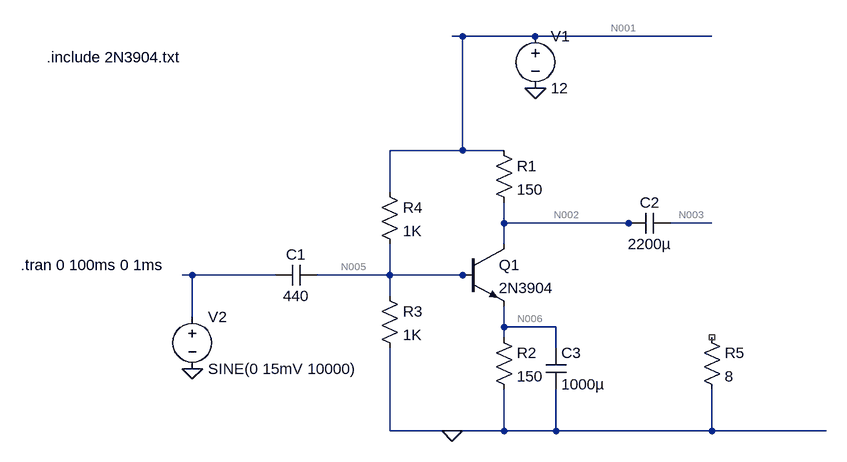
[diagram p0: schematic Common Emitter with 2N3904-1.asc]
Common Emitter with 2N3904-1.asc, the LTspice schematic file:
Version 4
SHEET 1 1032 680
WIRE 160 -256 144 -256
WIRE 272 -256 160 -256
WIRE 544 -256 272 -256
WIRE 160 -80 160 -256
WIRE 160 -80 48 -80
WIRE 224 -80 160 -80
WIRE 48 -16 48 -80
WIRE 224 32 224 0
WIRE 416 32 224 32
WIRE 432 32 416 32
WIRE 544 32 480 32
WIRE 224 64 224 32
WIRE -256 112 -272 112
WIRE -128 112 -256 112
WIRE 48 112 48 64
WIRE 48 112 -64 112
WIRE 160 112 48 112
WIRE 176 112 160 112
WIRE 48 144 48 112
WIRE -256 176 -256 112
WIRE 224 192 224 160
WIRE 304 192 224 192
WIRE 224 208 224 192
WIRE 304 224 304 192
WIRE 48 352 48 224
WIRE 144 352 48 352
WIRE 224 352 224 288
WIRE 224 352 144 352
WIRE 304 352 304 288
WIRE 304 352 224 352
WIRE 544 352 544 288
WIRE 544 352 304 352
WIRE 720 352 544 352
FLAG 272 -176 0
FLAG 144 352 0
FLAG -256 256 0
SYMBOL npn 160 64 R0
SYMATTR InstName Q1
SYMATTR Value 2N3904
SYMBOL res 208 -96 R0
SYMATTR InstName R1
SYMATTR Value 150
SYMBOL voltage 272 -272 R0
WINDOW 123 0 0 Left 2
WINDOW 39 0 0 Left 2
SYMATTR InstName V1
SYMATTR Value 12
SYMBOL res 32 -32 R0
SYMATTR InstName R4
SYMATTR Value 1K
SYMBOL res 32 128 R0
SYMATTR InstName R3
SYMATTR Value 1K
SYMBOL res 208 192 R0
SYMATTR InstName R2
SYMATTR Value 150
SYMBOL voltage -256 160 R0
WINDOW 123 0 0 Left 2
WINDOW 39 0 0 Left 2
SYMATTR InstName V2
SYMATTR Value SINE(0 15mV 10000)
SYMBOL res 528 192 R0
SYMATTR InstName R5
SYMATTR Value 8
SYMBOL cap -64 96 R90
WINDOW 0 0 32 VBottom 2
WINDOW 3 32 32 VTop 2
SYMATTR InstName C1
SYMATTR Value 440
SYMBOL cap 480 16 R90
WINDOW 0 0 32 VBottom 2
WINDOW 3 32 32 VTop 2
SYMATTR InstName C2
SYMATTR Value 2200µ
SYMBOL cap 288 224 R0
SYMATTR InstName C3
SYMATTR Value 1000µ
TEXT -520 96 Left 2 !.tran 0 100ms 0 1ms
TEXT -480 -224 Left 2 !.include 2N3904.txt

The netlist it stands for:
* Common Emitter with 2N3904-1.asc
Q1 N002 N005 N006 0 2N3904
R1 N001 N002 150
V1 N001 0 12
R4 N001 N005 1K
R3 N005 0 1K
R2 N006 0 150
V2 N004 0 SINE(0 15mV 10000)
R5 NC_01 0 8
C1 N005 N004 440
C2 N003 N002 2200µ
C3 N006 0 1000µ
.model NPN NPN
.model PNP PNP
.lib standard.bjt
.tran 0 100ms 0 1ms
.include 2N3904.txt
.backanno
.end

* Results of the author's LTspice run, read from the files saved beside the schematic
* Operating Point, zero values left out:
*   V(n002) = 6.835 V
*   V(n005) = 5.938 V
*   V(n006) = 5.184 V
*   V(n001) = 12 V
*   V(n003) = 15 mV
*   Ic(Q1) = 34.44 mA
*   Ib(Q1) = 123.5 µA
*   Ie(Q1) = -34.56 mA
*   I(C1) = 2.613 nA
*   I(R2) = 34.56 mA
*   I(R3) = 5.938 mA
*   I(R4) = 6.062 mA
*   I(R1) = 34.44 mA
*   I(V2) = 2.613 nA
*   I(V1) = -40.5 mA
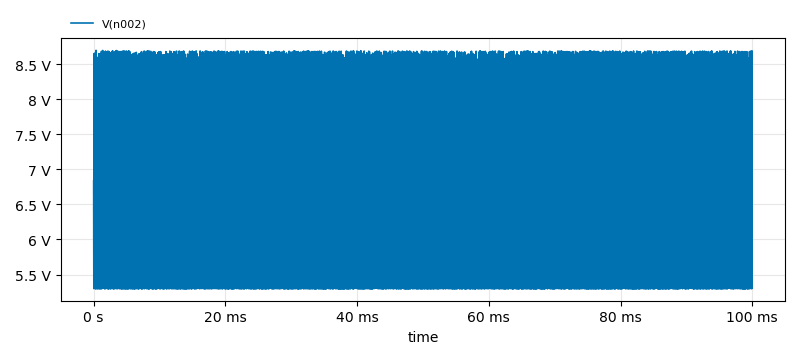
[diagram p1: Transient Analysis of Common Emitter with 2N3904-1.asc, plotted from the saved traces]
* Transient Analysis, 1 run:
*   V(n002): min 5.297 V, max 8.706 V, average 6.823 V, rms 6.949 V, last 6.803 V